# Altium schematic sheet Pi_USB_2_UART.SchDoc: =DocumentName
size B; DrawnBy: Cary Smith; Organization: Las Cumbres Observatoy; Address1: 6740 Cortona Dr.; Address2: Suite 102; Address3: Goleta, CA 93117; DocumentNumber: 1; Revision: 1; SheetNumber: 1; SheetTotal: 1000's
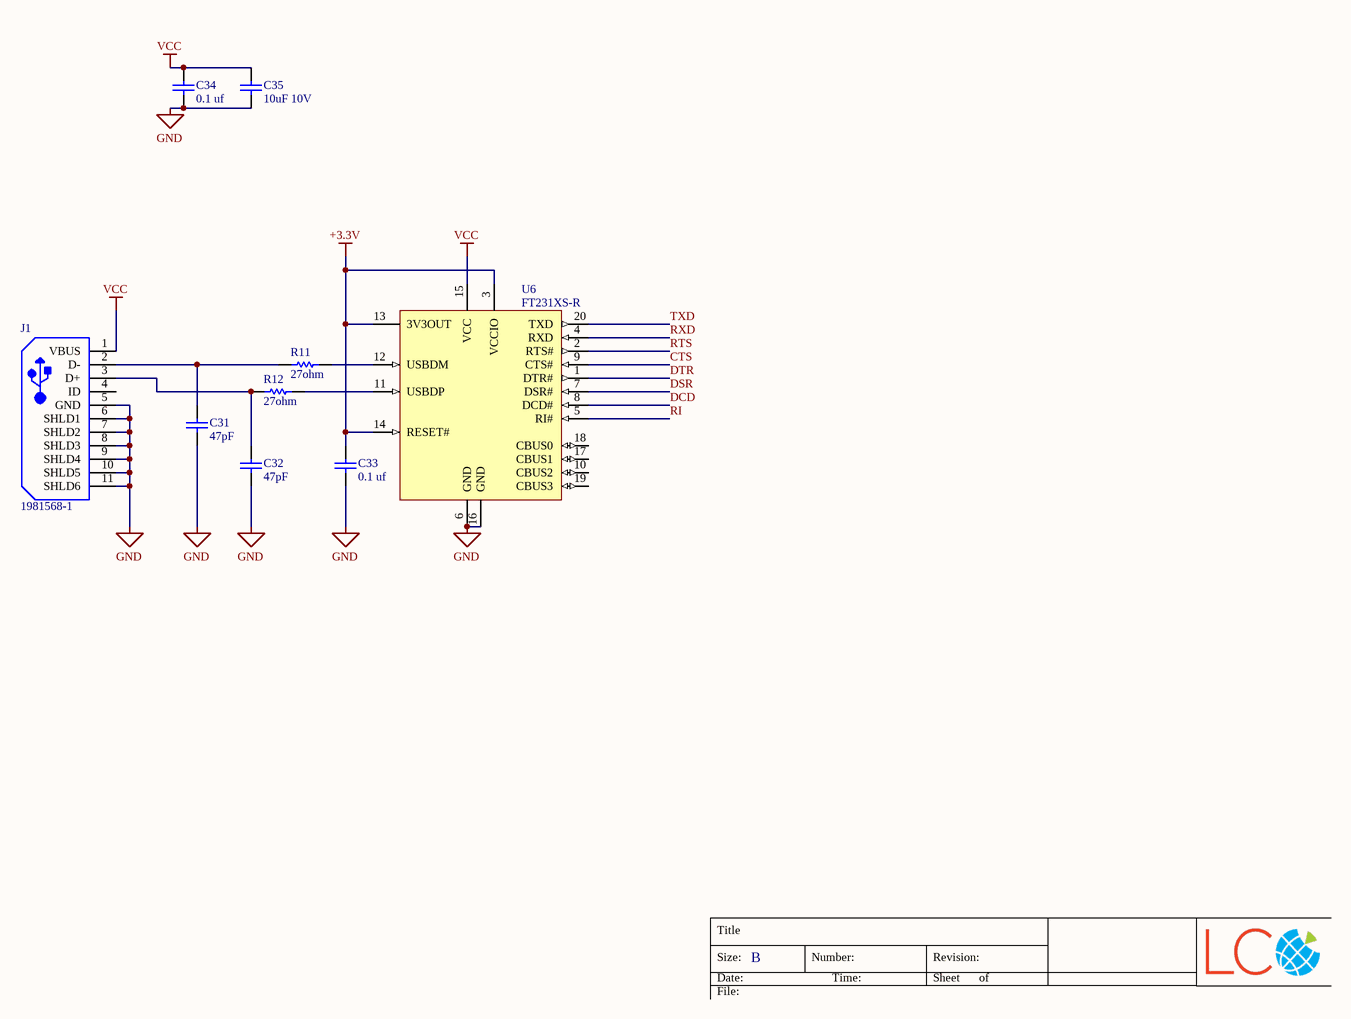
[diagram p0: Pi_USB_2_UART.SchDoc]

## Parts
C31  47pF  [CAPC1005X61X26NL10T16]
C32  47pF  [CAPC1005X61X26NL10T16]
C33  0.1 uf  [CAPC1608X92X38LL15T08]
C34  0.1 uf  [CAPC1608X92X38LL15T08]
C35  10uF 10V  [CAPC1609X100X15LL20]
J1  1981568-1  [TECO-1981568-5_V]
R11  27ohm  [RESC1005X40X25ML05T05]
R12  27ohm  [RESC1005X40X25ML05T05]
U6  FT231XS-R  [SSOP-20_L]

## Nets
+3.3V: C33.2 U6.3(VCCIO) U6.13(3V3OUT) U6.14(RESET#)
GND: C31.1 C32.1 C33.1 C34.1 C35.1 J1.5(GND) J1.6(SHLD1) J1.7(SHLD2) J1.8(SHLD3) J1.9(SHLD4) J1.10(SHLD5) J1.11(SHLD6) U6.6(GND) U6.16(GND)
VCC: C34.2 C35.2 J1.1(VBUS) U6.15(VCC)
CTS: U6.9(CTS#)
DCD: U6.8(DCD#)
DSR: U6.7(DSR#)
DTR: U6.1(DTR#)
RI: U6.5(RI#)
RTS: U6.2(RTS#)
RXD: U6.4(RXD)
TXD: U6.20(TXD)
NetC31_2: C31.2 J1.2(D-) R11.1
NetC32_2: C32.2 J1.3(D+) R12.1
NetR11_2: R11.2 U6.12(USBDM)
NetR12_2: R12.2 U6.11(USBDP)

Not connected (* = marked no-connect by the designer): J1 4(ID); U6 10(CBUS2) 17(CBUS1) 18(CBUS0) 19(CBUS3)

## Notes on the sheet
- Title
- Size:
- Date:
- B
- Number:
- Time:
- Revision:
- Sheet
- of
- File:

## Library data of the parts
C31 C32 = CMP-2008-02005-1: VJ0402D470JXAAJ; Manufacturer: Vitramon; Part Number: VJ0402D470JXAAJ
C33 C34 = CMP-2006-01974-1: VJ0603Y104KNXAO; Manufacturer: Vitramon; Part Number: VJ0603Y104KNXAO
C35 = CMP-2006-00193-1: TACL106M010XTA; Manufacturer: AVX Interconnect / Elco; Part Number: TACL106M010XTA
J1 = CMP-2000-05408-1: Micro USB Receptacle Standard Type B Assy, 5-Pin SMD, RoHS, Tape and Reel; Manufacturer: TE Connectivity; Body Orientation: RightAngle; Number of Ports: 1Port; Number of Contacts: 5POS; Gender: RCP; Voltage Rating Max: 30VAC; Product Depth (mm): 5.6mm; Pitch (mm): 0.65mm; Current Rating (Max): 1/ContactA; Product Length (mm): 8mm; Product Height (mm): 3mm; Operating Temperature Max Deg. C: 85C; Datasheet URL: http://www.mouser.com/ds/2/418/NG_CD_1981568_E2-621296.pdf; Termination Method: Solder; Number of Terminals: 5; Operating Temp Range: -55Cto85C; Mounting Style: SurfaceMount; Manufacturer URL: http://www.te.com/; Contact Material: CopperAlloy; Packaging: TapeandReel; Datasheet Version: Rev. E2, 08/2015; Operating Temperature Min Deg. C: -55C; Housing Material: Thermoplastic; Type: MicroUSB; Contact Plating: GoldOverNickel
R11 R12 = CMP-2002-08427-1: CRCW0402270RFKED; Manufacturer: Vishay Dale; Part Number: CRCW0402270RFKED
U6 = CMP-0248-00024-2: USB to Full-Handshake UART Interface Chip, UHCI/OHCI/EHCI Compatible, USB 2.0 Compatible, -40 to +85 degC, 20-Pin SSOP, Pb-Free, Tape and Reel; Manufacturer: FTDI; PackageVersion: Feb-13; PackageReference: SSOP-20; ComponentLink1Description: Manufacturer URL; ComponentLink2Description: Datasheet; PackageDescription: 20-Pin Small Outline Package, 8.6 x 3.9 mm Body, 0.635 mm Pitch; ComponentLink3URL: www.ftdichip.com/Products/ICs/FT231X.html; PartNumber: FT231XS-R; DatasheetVersion: ver 1.2, Feb-2013; ComponentLink2URL: http://www.ftdichip.com/Support/Documents/DataSheets/ICs/DS_FT231X.pdf; Code_JEDEC: MO-137-AD; ComponentLink3Description: FT231X Product Page; RevisionNote: DatasheetVersion updated to 1.2 Feb-2013; ComponentLink1URL: http://www.ftdichip.com/